# EasyEDA Pro project ProPrj_can sniffer_2026-02-20.epro

# Schematic Schematic1
Board Name: Board1; Create Date: 2026-02-18; Page Name: P1; Project Name: can sniffer; Schematic Name: Schematic1; Update Date: 2026-02-19; Company: EasyEDA.com; Page Size: A4; Version: V1.0
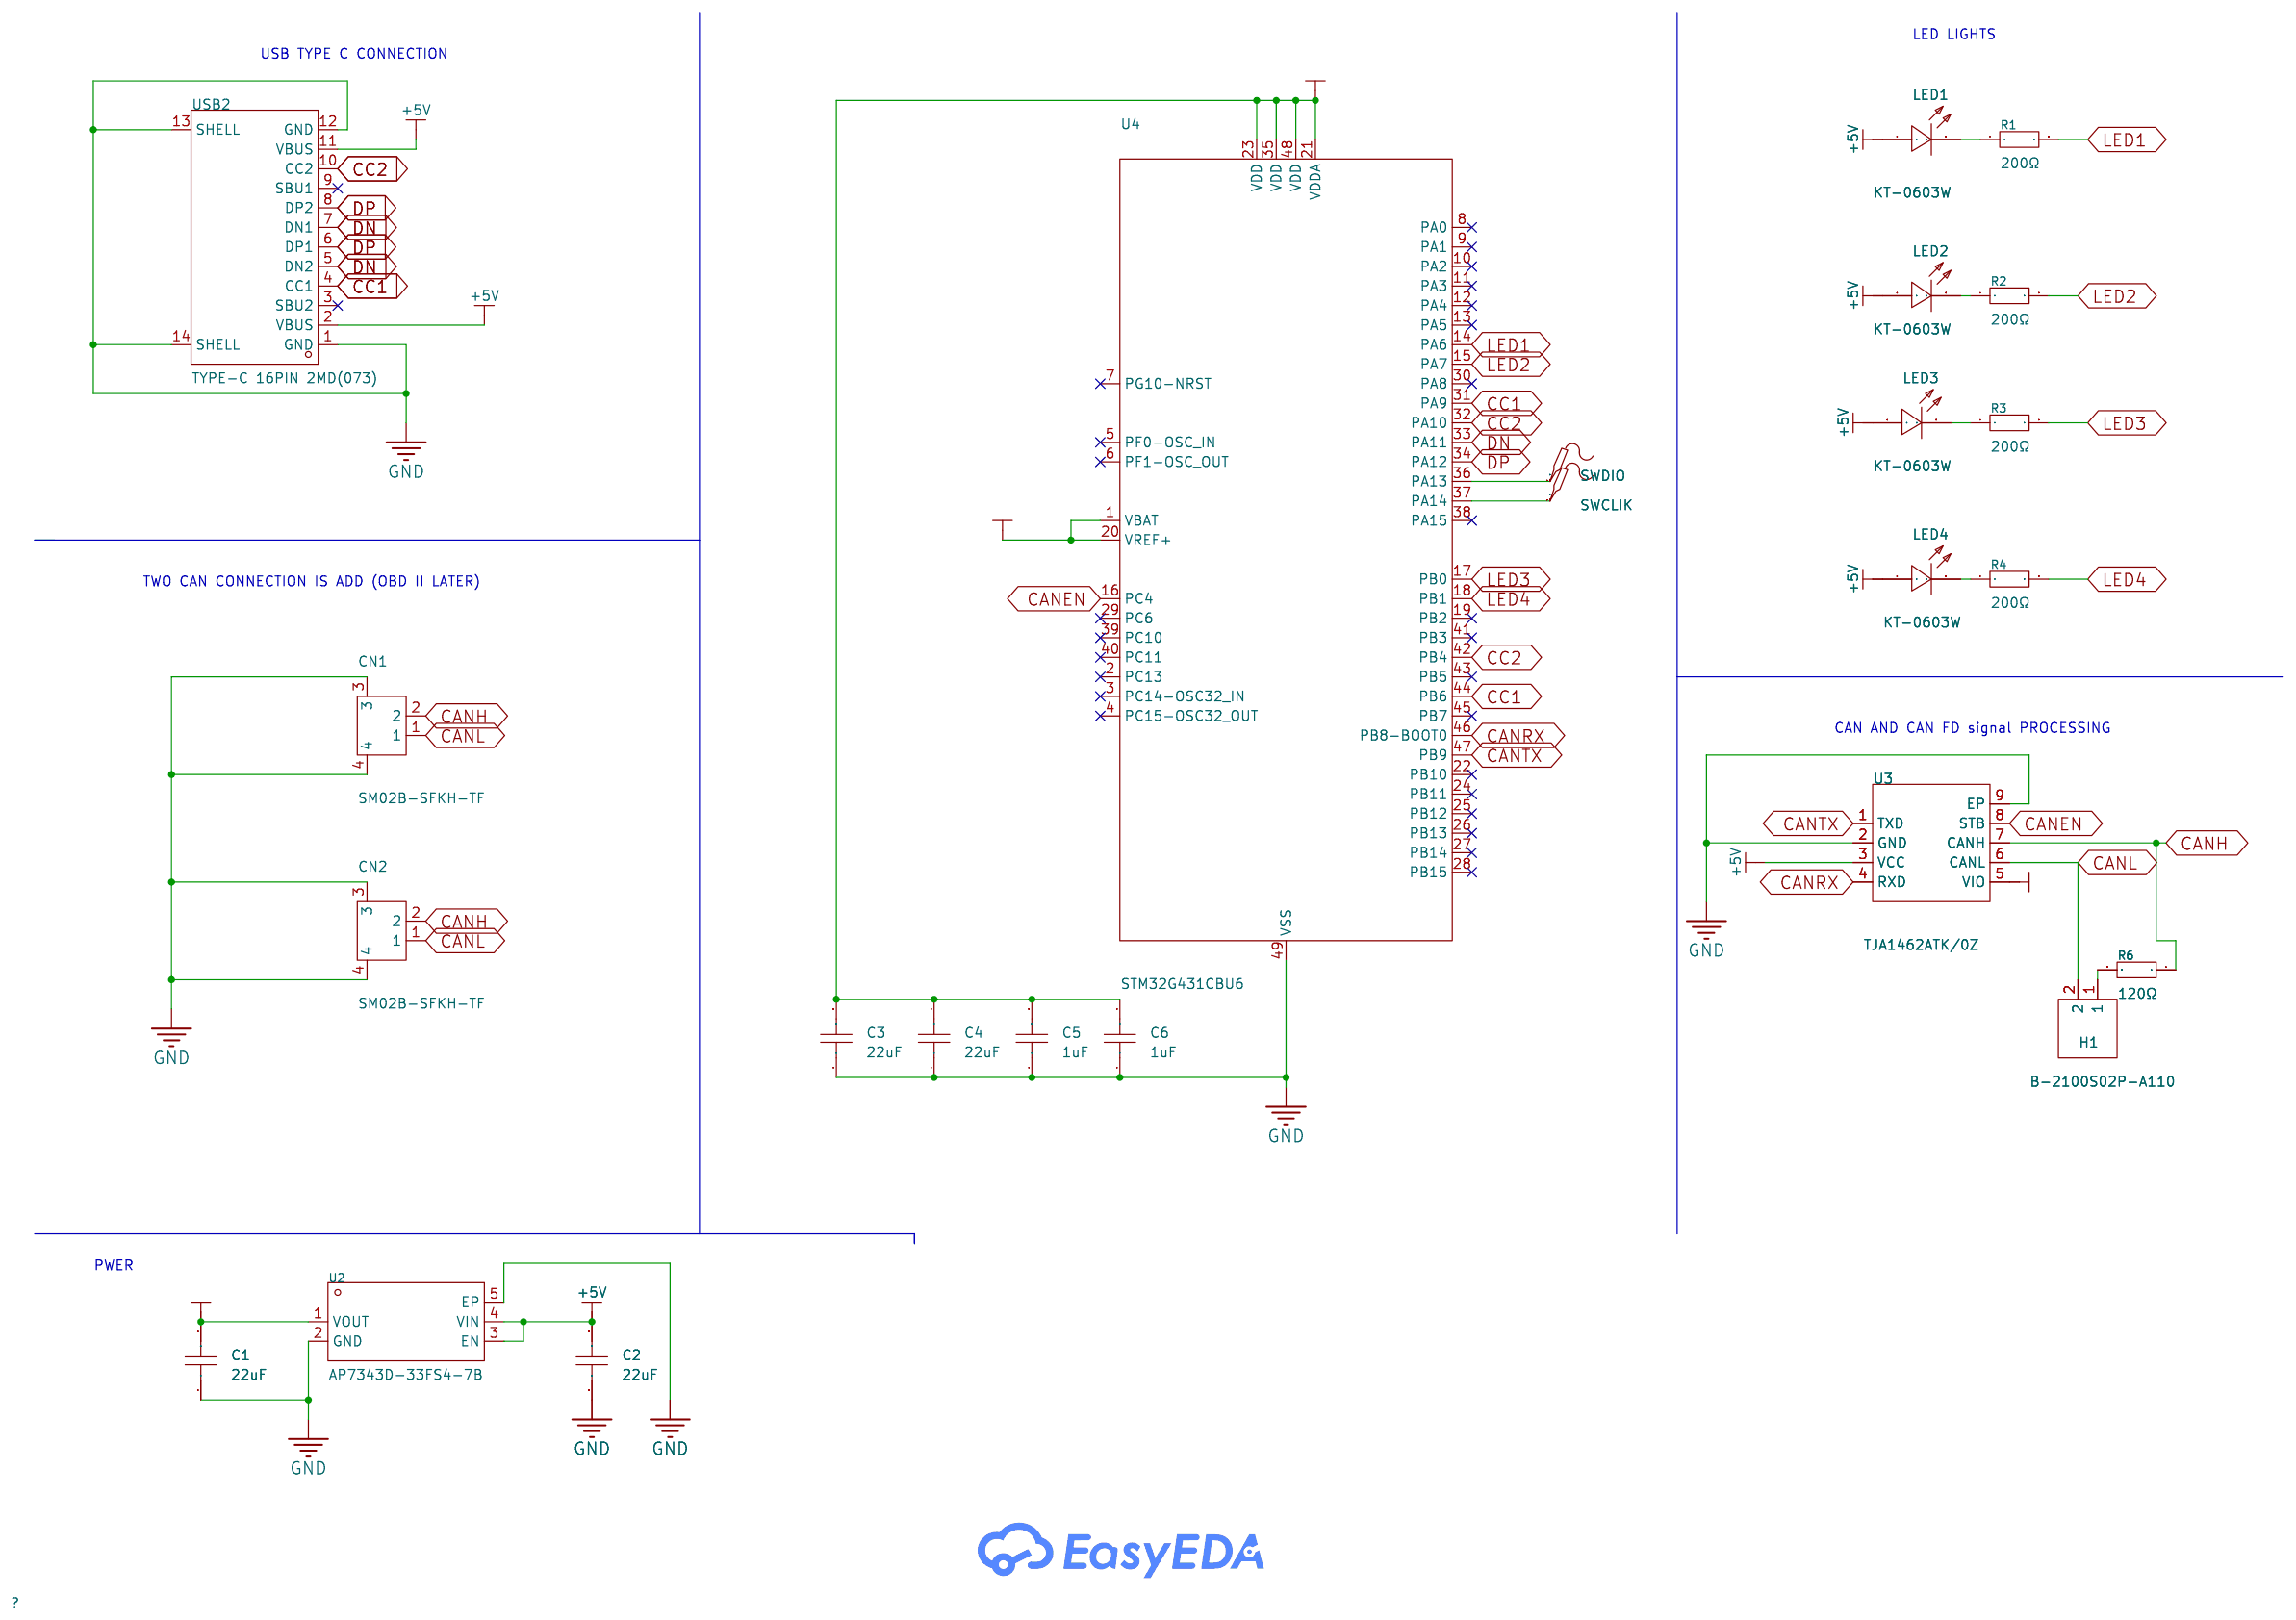
[diagram p0: schematic sheet]

## Parts
C1  22uF  [C0603]
C2  22uF  [C0603]
C3  22uF  [C0603]
C4  22uF  [C0603]
C5  1uF  [C0402]
C6  1uF  [C0402]
CN1  SM02B-SFKH-TF  [CONN-SMD_SM02B-SFKH-TF]
CN2  SM02B-SFKH-TF  [CONN-SMD_SM02B-SFKH-TF]
H1  B-2100S02P-A110  [HDR-TH_2P-P2.54-V-M-1]
LED1  KT-0603W  [LED0603-R-RD_WHITE]
LED2  KT-0603W  [LED0603-R-RD_WHITE]
LED3  KT-0603W  [LED0603-R-RD_WHITE]
LED4  KT-0603W  [LED0603-R-RD_WHITE]
R1  200Ω  [R0402]
R2  200Ω  [R0402]
R3  200Ω  [R0402]
R4  200Ω  [R0402]
R6  120Ω  [R0603]
SWCLIK  -  [Test-Point-0.5mm]
SWDIO  -  [Test-Point-0.5mm]
U2  AP7343D-33FS4-7B  [DFN-4_L1.0-W1.0-P0.65-BL-EP]
U3  TJA1462ATK/0Z  [HVSON-8_L3.0-W3.0-P0.65-TL-EP]
U4  STM32G431CBU6  [VQFN-48_L7.0-W7.0-P0.50-BL-EP5.5]
USB2  TYPE-C 16PIN 2MD(073)  [USB-C-SMD_TYPE-C-6PIN-2MD-073]

## Library data of the parts
C1-C4 = CL10A226MQ8NRNC: Capacitance:22uF Tolerance:±20% Tolerance:±20% Voltage Rating:6.3V Temperature Coefficient:X5R; LCSC Part Name: 22uF ±20% 6.3V; Supplier Part: C59461; Manufacturer: SAMSUNG(三星); Supplier Footprint: 0603; JLCPCB Part Class: Basic Part; Datasheet: https://item.szlcsc.com/datasheet/CL10A226MQ8NRNC/60514.html; Supplier: LCSC; Tolerance: ±20%; Voltage Rating: 6.3V; Temperature Coefficient: X5R
C5 C6 = CL05A105KA5NQNC: Capacitance:1uF Tolerance:±10% Tolerance:±10% Voltage Rating:25V Temperature Coefficient:X5R; LCSC Part Name: 1uF ±10% 25V; Supplier Part: C52923; Manufacturer: SAMSUNG(三星); Supplier Footprint: 0402; JLCPCB Part Class: Basic Part; Datasheet: https://item.szlcsc.com/datasheet/CL05A105KA5NQNC/53938.html; Supplier: LCSC; Tolerance: ±10%; Voltage Rating: 25V; Temperature Coefficient: X5R
CN1 CN2 = SM02B-SFKH-TF: Pins Structure:1x2P Pitch:1.8mm Mounting Type:Surface Mount, Right Angle Number of Pins:2P Number of Rows:1 Number of PINs Per Row:2 Current Rating:4A Contact Material:Brass Contact Plating:Tin Operating Temperature:-25℃~+85℃ Operating Temperature:-25℃~+8; LCSC Part Name: 1x2P 间距:1.8mm 卧贴; Supplier Part: C5329818; Manufacturer: JST; Supplier Footprint: SMD,P=1.8mm,卧贴; JLCPCB Part Class: Extended Part; Datasheet: https://item.szlcsc.com/datasheet/SM02B-SFKH-TF/6088577.html; Supplier: LCSC; Pins Structure: 1x2P; Pitch: 1.8mm; Mounting Type: Surface Mount, Right Angle; Number of Pins: 2P; Number of Rows: 1; Number of PINs Per Row: 2; Current Rating: 4A; Contact Material: Brass; Contact Plating: Tin; Operating Temperature: -25℃~+85℃; Voltage Rating: 250V; Flame Retardant Rating: UL94V-0; Color: Gray
H1 = B-2100S02P-A110: Pin Structure:1x2P Pitch:2.54mm Row Spacing:- Circluar Pins/Square Pins:- Mounting Type:Through Hole Number of Rows:1 Number of Pins:2P Current Rating:- Voltage Rating (Max):- Length of Mating Pin:6mm Insulation Height:2.54mm Length of End Connection Pin:; LCSC Part Name: 2.54直排针; Supplier Part: C124375; Manufacturer: Ckmtw(灿科盟); Supplier Footprint: 插件,P=2.54mm; JLCPCB Part Class: Extended Part; Datasheet: https://item.szlcsc.com/datasheet/B-2100S02P-A110/125650.html; Supplier: LCSC; Pin Structure: 1x2P; Pitch: 2.54mm; Mounting Type: Through Hole; Number of Rows: 1; Number of Pins: 2P; Length of Mating Pin: 6mm; Insulation Height: 2.54mm; Length of End Connection Pin: 3mm; Contact Material: Brass; Operating Temperature: -40℃~+105℃; Color: Black
LED1-LED4 = KT-0603W: Illumination Color:White Voltage - Forward(Vf):2.6V~3.1V Voltage - Forward(Vf):2.6V~3.1V Power(Watts):100mW Forward Current:5mA Diode Configuration:Discrete Diode Lens Color:Yellow Lens Luminous Intensity:360mcd Luminous Intensity:360mcd Viewing Angle:120; LCSC Part Name: 0603 白灯 高亮; Supplier Part: C2290; Manufacturer: KENTO; Supplier Footprint: 0603; JLCPCB Part Class: Basic Part; Datasheet: https://item.szlcsc.com/datasheet/KT-0603W/2663.html; Supplier: LCSC; Illumination Color: White; Voltage - Forward(Vf): 2.6V~3.1V; Power(Watts): 100mW; Forward Current: 5mA; Diode Configuration: Discrete Diode; Lens Color: Yellow Lens; Luminous Intensity: 360mcd; Viewing Angle: 120°; Mounting Style: Top-mount
R1-R4 = 0402WGF2000TCE: Type:Thick Film Resistor Resistance:200Ω Tolerance:±1% Tolerance:±1% Power(Watts):62.5mW Voltage-Supply(Max):50V Temperature Coefficient:±100ppm/℃ Temperature Coefficient:±100ppm/℃ Operating Temperature:-55℃~+155℃ Operating Temperature:-55℃~+155℃; LCSC Part Name: 200Ω ±1% 62.5mW 厚膜电阻; Supplier Part: C25087; Manufacturer: UNI-ROYAL(厚声); Supplier Footprint: 0402; JLCPCB Part Class: Basic Part; Datasheet: https://item.szlcsc.com/datasheet/0402WGF2000TCE/25830.html; Supplier: LCSC; Type: Thick Film Resistor; Tolerance: ±1%; Power(Watts): 62.5mW; Voltage-Supply(Max): 50V; Temperature Coefficient: ±100ppm/℃; Operating Temperature: -55℃~+155℃
R6 = 0603WAF1200T5E: Type:Thick Film Resistor Resistance:120Ω Tolerance:±1% Tolerance:±1% Power(Watts):100mW Voltage-Supply(Max):75V Temperature Coefficient:±100ppm/℃ Temperature Coefficient:±100ppm/℃ Operating Temperature:-55℃~+155℃ Operating Temperature:-55℃~+155℃; LCSC Part Name: 120Ω ±1% 100mW 厚膜电阻; Supplier Part: C22787; Manufacturer: UNI-ROYAL(厚声); Supplier Footprint: 0603; JLCPCB Part Class: Basic Part; Datasheet: https://item.szlcsc.com/datasheet/0603WAF1200T5E/23514.html; Supplier: LCSC; Type: Thick Film Resistor; Tolerance: ±1%; Power(Watts): 100mW; Voltage-Supply(Max): 75V; Temperature Coefficient: ±100ppm/℃; Operating Temperature: -55℃~+155℃
SWCLIK SWDIO = Test-Point: Test Point 测试点
U2 = AP7343D-33FS4-7B: Output Type:Fixed Voltage - Supply:5.25V Output Voltage:3.3V Output Voltage:3.3V Output Current:300mA Power Supply Rejection Ratio (PSRR):75dB@(1kHz) Voltage Dropout:290mV@(300mA) standby current:60uA Noise:60uVrms Features:Enable；Thermal Shutdown；Short C; LCSC Part Name: 输入5.25V 输出3.3V 300mA; Supplier Part: C260892; Manufacturer: DIODES(美台); Supplier Footprint: X2-DFN1010-4-EP; JLCPCB Part Class: Extended Part; Datasheet: https://item.szlcsc.com/datasheet/AP7343D-33FS4-7B/252756.html; Supplier: LCSC; Output Type: Fixed; Voltage - Supply: 5.25V; Output Voltage: 3.3V; Output Current: 300mA; Power Supply Rejection Ratio (PSRR): 75dB@(1kHz); Voltage Dropout: 290mV@(300mA); standby current: 60uA; Noise: 60uVrms; Features: Enable；Thermal Shutdown；Short Circuit Protection; Operating Temperature: -40℃~+85℃@(Ta); Output Configuration: Positive; Number of Outputs: 1
U3 = TJA1462ATK/0Z: Type:CAN FD Transceiver Data Rate:8Mbps Voltage - Supply:4.5V~5.5V Voltage - Supply:4.5V~5.5V Current - Supply:70mA Operating Temperature:-40℃~+150℃ Operating Temperature:-40℃~+150℃ Supply Current (Iq):2uA; LCSC Part Name: 具备待机模式的CAN FD信号增强型收发器; Supplier Part: C3229259; Manufacturer: NXP(恩智浦); Supplier Footprint: HVSON-8-EP(3x3); JLCPCB Part Class: Extended Part; Datasheet: https://www.nxp.com/docs/en/data-sheet/TJA1462.pdf; Supplier: LCSC; Type: CAN FD Transceiver; Data Rate: 8Mbps; Voltage - Supply: 4.5V~5.5V; Current - Supply: 70mA; Operating Temperature: -40℃~+150℃; Supply Current (Iq): 2uA
U4 = STM32G431CBU6: CPU Core:ARM Cortex-M Series CPU Maximum Speed:170MHz Program Storage Size:128KB Program Memory Type:FLASH Number of I/O:42 ADC (Bit):12bit DAC (Bit):12bit Voltage - Supply:1.71V~3.6V Voltage - Supply:1.71V~3.6V Applications:-; LCSC Part Name: 带DSP和FPU的170MHz主流ARM Cortex-M4 MCU，具有128 KB Flash存储器、数学加速器和中等模拟电平集成; Supplier Part: C529356; Manufacturer: ST(意法半导体); Supplier Footprint: UFQFPN-48(7x7); JLCPCB Part Class: Extended Part; Datasheet: https://item.szlcsc.com/datasheet/STM32G431CBU6/549634.html; Supplier: LCSC; CPU Core: ARM Cortex-M Series; CPU Maximum Speed: 170MHz; Program Storage Size: 128KB; Program Memory Type: FLASH; Number of I/O: 42; ADC (Bit): 12bit; DAC (Bit): 12bit; Voltage - Supply: 1.71V~3.6V
USB2 = TYPE-C 16PIN 2MD(073): Connector Type:Type-C Protocol Standard:- Gender:Female Mounting Type:Surface Mount, Right Angle Number of Contacts:16P Number of Ports:1 Current Rating-Power:3A Voltage Rating:5V Connect-Disconnect Life:5,000 times Supplementary Features:- Center Height:; LCSC Part Name: 16P卧贴母座; Supplier Part: C2765186; Manufacturer: SHOU HAN(首韩); Supplier Footprint: SMD; JLCPCB Part Class: Extended Part; Datasheet: https://item.szlcsc.com/datasheet/TYPE-C%252016PIN%25202MD(073)/2901843.html; Supplier: LCSC; Connector Type: Type-C; Gender: Female; Mounting Type: Surface Mount, Right Angle; Number of Contacts: 16P; Number of Ports: 1; Current Rating-Power: 3A; Voltage Rating: 5V; Connect-Disconnect Life: 5,000 times; Detection color: Black; Operating Temperature: -25℃~+85℃

## Nets
3V3: C1.2 C3.2 C4.2 C5.2 C6.2 U2.1(VOUT) U3.5(VIO) U4.1(VBAT) U4.20(VREF+) U4.21(VDDA) U4.23(VDD) U4.35(VDD) U4.48(VDD)
+5V: C2.2 LED1.1(A) LED2.1(A) LED3.1(A) LED4.1(A) U2.3(EN) U2.4(VIN) U3.3(VCC) USB2.2(VBUS) USB2.11(VBUS)
GND: C1.1 C2.1 C3.1 C4.1 C5.1 C6.1 CN1.3 CN1.4 CN2.3 CN2.4 U2.2(GND) U2.5(EP) U3.2(GND) U3.9(EP) U4.49(VSS) USB2.1(GND) USB2.12(GND) USB2.13(SHELL) USB2.14(SHELL)
CANEN: U3.8(STB) U4.16(PC4)
CANH: CN1.2 CN2.2 R6.1 U3.7(CANH)
CANL: CN1.1 CN2.1 H1.2 U3.6(CANL)
CANRX: U3.4(RXD) U4.46(PB8-BOOT0)
CANTX: U3.1(TXD) U4.47(PB9)
CC1: U4.31(PA9) U4.44(PB6) USB2.4(CC1)
CC2: U4.32(PA10) U4.42(PB4) USB2.10(CC2)
DN: U4.33(PA11) USB2.5(DN2) USB2.7(DN1)
DP: U4.34(PA12) USB2.6(DP1) USB2.8(DP2)
LED1: R1.2 U4.14(PA6)
LED2: R2.2 U4.15(PA7)
LED3: R3.2 U4.17(PB0)
LED4: R4.2 U4.18(PB1)
$1N952: LED1.2(K) R1.1
$1N985: LED2.2(K) R2.1
$1N1015: LED3.2(K) R3.1
$1N1045: LED4.2(K) R4.1
$1N5486: H1.1 R6.2
Net-(SWCLIK-1): SWCLIK.1 U4.37(PA14)
Net-(SWDIO-1): SWDIO.1 U4.36(PA13)

Not connected (* = marked no-connect by the designer): U4 2(PC13)* 3(PC14-OSC32_IN)* 4(PC15-OSC32_OUT)* 5(PF0-OSC_IN)* 6(PF1-OSC_OUT)* 7(PG10-NRST)* 8(PA0)* 9(PA1)* 10(PA2)* 11(PA3)* 12(PA4)* 13(PA5)* 19(PB2)* 22(PB10)* 24(PB11)* 25(PB12)* 26(PB13)* 27(PB14)* 28(PB15)* 29(PC6)* 30(PA8)* 38(PA15)* 39(PC10)* 40(PC11)* 41(PB3)* 43(PB5)* 45(PB7)*; USB2 3(SBU2)* 9(SBU1)*

## Notes on the sheet
- LED LIGHTS
- USB TYPE C CONNECTION
- TWO CAN CONNECTION IS ADD (OBD II LATER)
- CAN AND CAN FD signal PROCESSING
- PWER

# Board PCB1
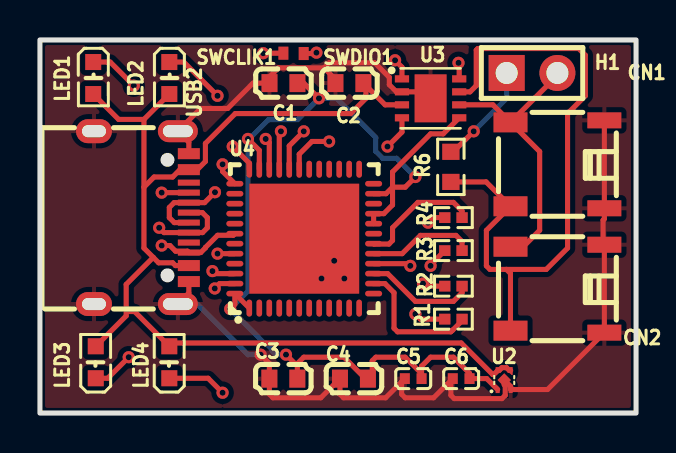
[diagram p1: board, top side]
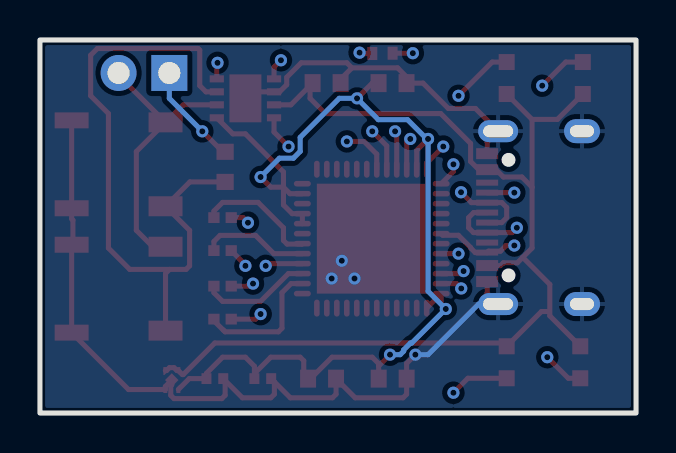
[diagram p2: board, bottom side, seen from below]

Outline 29.84 x 18.67 mm; copper layers: Top Layer, Inner1, Inner2, Bottom Layer. Coordinates in mm from the lower left corner of the outline.
Outline path: rectangle 0,18.67 29.84,0
Stack: Top Layer 0.035mm Outer layer thickness 1oz / Dielectric1 0.2104mm 7628 RC49% 8.6mil / Inner1 0.0152mm Inner layer thickness / Dielectric2 1.065mm 1.1mm H/HOZ Copper / Inner2 0.0152mm Inner layer thickness / Dielectric3 0.2104mm 7628 RC49% 8.6mil / Bottom Layer 0.035mm Outer layer thickness 1oz

## Design rules (mm)
template: JLCPCB Capability(Two Layers Board)
spacing copperThickness1oz (default): track to track 0.102, other pairs 0.152 to 0.3
spacing copperThickness2oz: track to track 0.203, other pairs 0.152 to 0.3
track width copperThickness1oz (default): min 0.127, default 0.254, max 2.54
track width copperThickness2oz: min 0.203, default 0.254, max 2.54
differential pair differentialPair (default): width min 0.127, default 0.254, max 2.54; gap min 0.152, default 0.152
via viaSize (default): diameter min 0.5, default 0.61, max 10; hole min 0.3, default 0.305, max 6.3

## Placement (name value [footprint] x y rotation side)
C1  22uF  [C0603]  12.19 16.51 0 top
C2  22uF  [C0603]  15.49 16.51 0 top
C3  22uF  [C0603]  12.19 1.72 0 top
C4  22uF  [C0603]  15.72 1.72 0 top
C5  1uF  [C0402]  18.69 1.72 0 top
C6  1uF  [C0402]  21.09 1.72 0 top
CN1  SM02B-SFKH-TF  [CONN-SMD_SM02B-SFKH-TF]  25.91 12.45 180 top
CN2  SM02B-SFKH-TF  [CONN-SMD_SM02B-SFKH-TF]  25.91 6.22 180 top
H1  B-2100S02P-A110  [HDR-TH_2P-P2.54-V-M-1]  24.64 17.02 0 top
LED1  KT-0603W  [LED0603-R-RD_WHITE]  2.67 16.76 270 top
LED2  KT-0603W  [LED0603-R-RD_WHITE]  6.48 16.76 270 top
LED3  KT-0603W  [LED0603-R-RD_WHITE]  2.79 2.54 90 top
LED4  KT-0603W  [LED0603-R-RD_WHITE]  6.48 2.54 90 top
R1  200Ω  [R0402]  20.7 4.7 0 top
R2  200Ω  [R0402]  20.7 6.35 0 top
R3  200Ω  [R0402]  20.7 8.13 0 top
R4  200Ω  [R0402]  20.7 9.78 0 top
R6  120Ω  [R0603]  20.57 12.32 90 top
SWCLIK1  -  [Test-Point-0.5mm]  12.19 18.01 0 top
SWDIO1  -  [Test-Point-0.5mm]  13.2 17.99 0 top
U2  AP7343D-33FS4-7B  [DFN-4_L1.0-W1.0-P0.65-BL-EP]  23.24 1.65 0 top
U3  TJA1462ATK/0Z  [HVSON-8_L3.0-W3.0-P0.65-TL-EP]  19.56 15.75 0 top
U4  STM32G431CBU6  [VQFN-48_L7.0-W7.0-P0.50-BL-EP5.5]  13.23 8.73 0 top
USB2  TYPE-C 16PIN 2MD(073)  [USB-C-SMD_TYPE-C-6PIN-2MD-073]  5.08 9.78 270 top

## Footprints (pads in the part's own frame, mm; a bottom-side part is the same pattern mirrored in y, then rotated)
C0402
  rect 0.5x0.54 smd: 1(-0.42,0) 2(0.42,0)
C0603
  rect 0.8x0.9 smd: 1(-0.7,0) 2(0.7,0)
CONN-SMD_SM02B-SFKH-TF
  rect 1.7x1 smd: 1(2.35,-2.1) 2(2.35,2.1)
  rect 1.7x0.8 smd: 3(-2.35,2.2) 4(-2.35,-2.2)
DFN-4_L1.0-W1.0-P0.65-BL-EP
  custom 0.2x0.4 smd: 1(-0.325,-0.475) 2(0.325,-0.474) 3(0.325,0.475) 4(-0.325,0.475)
  rect 0.48x0.48 smd rot 45: 5(0.004,0.001)
HDR-TH_2P-P2.54-V-M-1
  rect 1.8x1.8 hole 1.1: 1(-1.27,0)
  round 1.8 hole 1.1: 2(1.27,0)
HVSON-8_L3.0-W3.0-P0.65-TL-EP
  rect 0.711x0.355 smd: 1(-1.433,0.975) 2(-1.433,0.325) 3(-1.433,-0.325) 4(-1.433,-0.975) 5(1.433,-0.975) 6(1.433,-0.325) 7(1.433,0.325) 8(1.433,0.975)
  rect 1.6x2.4 smd: 9(0,0)
LED0603-R-RD_WHITE
  rect 0.8x0.8 smd: 1(0.8,0) 2(-0.8,0)
R0402
  rect 0.566x0.54 smd: 1(-0.433,0) 2(0.433,0)
R0603
  rect 0.806x0.864 smd: 1(-0.753,0) 2(0.753,0)
Test-Point-0.5mm
  rect 0.5x0.653 smd: 1(0,0)
USB-C-SMD_TYPE-C-6PIN-2MD-073
  rect 0.55x1.1 smd: 1(-3.2,2.375) 2(-2.4,2.375) 11(2.4,2.375) 12(3.2,2.375)
  rect 0.3x1.1 smd: 3(-1.75,2.375) 4(-1.25,2.375) 5(-0.75,2.375) 6(-0.25,2.375) 7(0.25,2.375) 8(0.75,2.375) 9(1.25,2.375) 10(1.75,2.375)
  oval 1.1x2 hole 0.6x1.5: 13(-4.325,1.825) 14(4.325,1.825)
  oval 1.2x1.8 hole 0.6x1.2: 13(-4.325,-2.375) 14(4.325,-2.375)
VQFN-48_L7.0-W7.0-P0.50-BL-EP5.5
  oval 0.28x0.85 smd: 1(-2.75,-3.474) 2(-2.25,-3.474) 3(-1.75,-3.474) 4(-1.25,-3.474) 5(-0.75,-3.474) 6(-0.25,-3.474) 7(0.25,-3.474) 8(0.75,-3.474) 9(1.25,-3.474) 10(1.75,-3.474) 11(2.25,-3.474) 12(2.75,-3.474) 25(2.75,3.474) 26(2.25,3.474) 27(1.75,3.474) 28(1.25,3.474) 29(0.75,3.474) 30(0.25,3.474) 31(-0.25,3.474) 32(-0.75,3.474) 33(-1.25,3.474) 34(-1.75,3.474) 35(-2.25,3.474) 36(-2.75,3.474)
  oval 0.85x0.28 smd: 13(3.474,-2.75) 14(3.474,-2.25) 15(3.474,-1.75) 16(3.474,-1.25) 17(3.474,-0.75) 18(3.474,-0.25) 19(3.474,0.25) 20(3.474,0.75) 21(3.474,1.25) 22(3.474,1.75) 23(3.474,2.25) 24(3.474,2.75) 37(-3.474,2.75) 38(-3.474,2.25) 39(-3.474,1.75) 40(-3.474,1.25) 41(-3.474,0.75) 42(-3.474,0.25) 43(-3.474,-0.25) 44(-3.474,-0.75) 45(-3.474,-1.25) 46(-3.474,-1.75) 47(-3.474,-2.25) 48(-3.474,-2.75)
  rect 5.5x5.5 smd: 49(0,0)

## Nets
As in the schematic, except:
$1N6179: SWCLIK1.1 U4.37
$1N6197: SWDIO1.1 U4.36

Pads without a net: U4 2 3 4 5 6 7 8 9 10 11 12 13 19 22 24 25 26 27 28 29 30 38 39 40 41 43 45; USB2 3 9

## Via types
v1: diameter 0.61, hole 0.305, Top Layer to Bottom Layer, 37 vias

## Routing (per net, layer and track width the routed paths; a pad name or vN(x,y) marks a point on that pad's centre or on a via; arc(x,y) is an arc through that point)
3V3: length 54.1
  Top Layer w0.254: 12.89,2.35 12.89,2.47 13.21,2.79 15.22,2.79 16.29,1.72 C4.2 16.64,1.94 16.64,2.61 16.82,2.79 18.29,2.79 19.11,1.97 ; 12.89,2.35 v1(12.32,2.92) ; 12.89,2.35 C3.2 ; v1(13.97,15.75) 13.21,16.51 C1.2 ; 17.65,11.3 17.33,10.98 U4.23 ; 17.65,11.3 18.29,11.3 v1(18.8,11.81) ; 17.65,11.3 17.65,12.06 19.56,13.97 20.19,13.97 U3.5 ; 17.65,11.3 17.65,10.41 17.22,9.98 U4.21 U4.20 ; 19.11,1.97 19.11,2.34 19.56,2.79 20.7,2.79 21.51,1.99 C6.2 22.37,1.72 U2.1 ; 19.11,1.97 C5.2 ; U4.35 10.98,13.15 v1(10.41,13.72) ; U4.1 9.76,5.98 9.76,5.44 v1(9.53,5.21)
  Bottom Layer w0.254: v1(18.8,11.81) 17.86,12.75 17.16,12.75 16.81,13.09 16.81,13.79 14.86,15.75 v1(13.97,15.75) 12.9,14.68 11.44,14.68 10.48,13.72 v1(10.41,13.72) 10.41,6.1 v1(9.53,5.21) 11.23,3.5 11.29,3.5 11.63,3.16 11.63,3.1 11.81,2.92 v1(12.32,2.92)
+5V: length 56.6
  Top Layer w0.254: 16.32,16.38 17.28,15.42 U3.3 ; 16.32,16.38 16.32,15.75 15.56,14.99 9.78,14.99 8.28,13.49 8.28,12.59 7.87,12.18 USB2.2 7.01,12.18 6.64,11.81 5.72,11.81 5.21,11.3 ; 16.32,16.38 C2.2 ; 5.67,7.79 4.32,6.44 4.32,4.86 2.79,3.34 ; 5.67,7.79 5.21,8.25 5.21,11.3 ; 5.67,7.79 5.94,7.52 6.65,7.52 6.78,7.38 USB2.11 ; LED1.1 3.94,14.69 5.21,14.69 ; U2.3 23.5,2.13 23.36,2.27 23.13,2.27 22.99,2.13 U2.4 22.71,1.92 22.67,1.92 21.09,3.5 6.68,3.5 6.67,3.49 ; 6.48,3.34 4.74,5.08 4.45,5.08 ; 5.21,11.3 5.21,14.69 ; 5.21,14.69 LED2.1
GND: length 60
  Top Layer w0.254: 14.22,17.27 14.48,17.53 16.76,17.53 17.49,16.8 17.49,16.43 17.85,16.07 U3.2 19.23,16.07 U3.9 ; 14.22,17.27 14.79,16.7 C2.1 ; 14.22,17.27 11.94,17.27 11.49,16.83 C1.1 10.67,16.51 9.4,15.24 8.04,15.24 USB2.13 7.46,13.55 USB2.1 ; USB2.14 7.46,6 USB2.12 ; 18.11,1.56 17.31,0.76 15.2,0.76 15.02,0.94 C4.1 14.06,0.76 11.67,0.76 11.49,0.94 C3.1 11.49,2.48 v1(11.05,2.92) ; 18.11,1.56 C5.1 ; 18.11,1.56 18.11,0.94 18.29,0.76 19.71,0.76 20.57,1.63 ; 20.57,1.63 C6.1 ; 20.57,1.63 20.57,0.89 20.74,0.72 23.13,0.72 23.3,0.88 23.3,1.37 23.25,1.42 U2.5 23.57,1.33 U2.2 25.41,1.18 CN2.3 CN2.4 28.19,8.49 28.19,9.65 28.26,9.72 CN1.3 CN1.4
  Bottom Layer w0.254: USB2.14 7.88,5.45 10.41,2.92 v1(11.05,2.92)
  vias: v1(14.1,6.73) v1(14.73,7.62) v1(15.24,6.73)
CANEN: length 13.9
  Top Layer w0.254: v1(18.54,7.37) 18.43,7.48 U4.16 ; U3.8 20.99,17.49 v1(20.96,17.53)
  Inner1 w0.254: v1(18.54,7.37) 18.85,7.67 18.85,9.77 20.96,11.88 v1(20.96,17.53)
CANH: length 33.1
  Top Layer w0.254: R6.1 22.34,11.57 CN1.2 22.35,9.14 22.35,7.37 22.53,7.19 23.36,7.19 ; CN2.2 23.56,6.98 23.36,7.19 ; 23.36,7.19 25.35,7.19 26.42,8.25 26.42,14.99 27.31,15.88 27.31,17.91 26.97,18.24 21.93,18.24 21.84,18.16 21.84,16.38 21.53,16.07 U3.7
CANL: length 14.2
  Top Layer w0.254: CN2.1 24.2,8.32 25.02,9.14 25.02,13.08 CN1.1 ; CN1.1 25.91,16.9 H1.2 ; CN1.1 22.68,15.42 U3.6
CANRX: length 14.3
  Top Layer w0.254: v1(8.64,7.1) 8.76,6.98 9.76,6.98 ; v1(17.4,13.33) 18.13,14.06 U3.4
  Inner2 w0.254: v1(8.64,7.1) 11.17,7.1 v1(17.4,13.33)
CANTX: length 20.1
  Top Layer w0.254: U3.1 18.13,17.31 v1(17.78,17.65) ; v1(8.75,6.23) 8.99,6.48 9.76,6.48
  Inner2 w0.254: v1(17.78,17.65) 19.05,16.38 19.05,13.59 11.7,6.23 v1(8.75,6.23)
CC1: length 21.5
  Top Layer w0.254: U4.31 12.98,12.95 13.62,13.59 v1(14.48,13.59) ; USB2.4 v1(6.1,11.03) ; 9.76,7.98 v1(8.89,7.98)
  Inner2 w0.254: v1(14.48,13.59) 14.48,11.56 11.05,8.13 9.04,8.13 v1(8.89,7.98) 6.52,7.98 6.34,7.8 5.85,7.8 5.68,7.98 5.01,7.98 4.83,8.16 4.83,9.76 v1(6.1,11.03)
CC2: length 18
  Top Layer w0.254: v1(6.1,8.38) 6.51,8.38 6.79,8.1 7.38,8.1 USB2.10 8.05,8.03 8.28,8.26 8.28,8.28 8.89,8.89 9.68,8.89 9.76,8.98 ; v1(13.21,14.1) 12.48,13.37 U4.32
  Inner2 w0.254: v1(13.21,14.1) 13.59,13.72 13.59,11.56 13.41,11.38 12.39,11.38 9.5,8.48 9.21,8.48 9.13,8.56 8.65,8.56 8.47,8.38 v1(6.1,8.38)
DN: length 12.1
  Top Layer w0.254: USB2.7 6.73,9.53 6.48,9.78 6.48,10.29 6.72,10.53 USB2.5 8.24,10.53 v1(8.76,11.05) ; U4.33 11.98,14.01 v1(12.06,14.1)
  Inner2 w0.254: v1(12.06,14.1) 12.06,12.06 10.8,10.8 9.02,10.8 v1(8.76,11.05)
DP: length 13.3
  Top Layer w0.254: v1(11.3,13.72) 11.48,13.54 U4.34 ; USB2.6 8.13,10.03 8.38,9.78 8.38,9.27 8.14,9.03 USB2.8 6.21,9.03 v1(5.97,9.27)
  Inner2 w0.254: v1(5.97,9.27) 6.86,9.27 8.18,10.59 8.18,11.29 8.52,11.63 9.22,11.63 v1(11.3,13.72)
LED1: length 6.8
  Top Layer w0.254: R1.2 21.13,4.62 20.67,4.15 20.66,4.15 20.57,4.06 17.91,4.06 17.73,4.24 17.73,6.02 17.27,6.48 16.71,6.48
LED2: length 5.5
  Top Layer w0.254: R2.2 21.13,6.02 20.7,5.59 18.8,5.59 17.41,6.98 U4.15
LED3: length 5.4
  Top Layer w0.254: R3.2 21.13,8.58 20.83,8.89 19.05,8.89 18.14,7.98 U4.17
LED4: length 6.2
  Top Layer w0.254: R4.2 21.13,10.11 20.7,10.54 18.92,10.54 17.65,9.27 17.65,8.64 17.47,8.46 16.73,8.46 U4.18
$1N952: length 24.7
  Top Layer w0.254: v1(18.8,4.95) 19.05,4.7 R1.1 ; LED1.2 3.52,17.56 v1(4.7,16.38)
  Inner1 w0.254: v1(18.8,4.95) 11.89,11.86 8.9,11.86 8.56,12.2 8.56,15.19 7.37,16.38 v1(4.7,16.38)
$1N985: length 23
  Top Layer w0.254: v1(8.89,15.88) 7.2,17.56 LED2.2 ; v1(19.18,6.48) 19.3,6.35 R2.1
  Inner1 w0.254: v1(19.18,6.48) 18.16,6.48 11.89,12.75 11.89,13.47 11.93,13.51 13.45,13.51 13.79,13.85 13.79,14.34 13.45,14.68 9.96,14.68 8.89,15.75 v1(8.89,15.88)
$1N1015: length 22.6
  Top Layer w0.254: v1(19.56,7.37) 19.56,7.42 R3.1 ; v1(4.45,2.79) 3.39,1.74 LED3.2
  Inner1 w0.254: v1(4.45,2.79) 10.35,2.79 10.81,2.34 12.56,2.34 13.02,2.79 17.65,2.79 20.19,5.33 20.19,6.73 v1(19.56,7.37)
$1N1045: length 22.6
  Top Layer w0.254: v1(9.14,1.02) 8.42,1.74 LED4.2 ; R4.1 19.69,9.78 v1(19.43,9.52)
  Inner1 w0.254: v1(19.43,9.52) 21.34,7.62 21.34,5.84 16.51,1.02 v1(9.14,1.02)
$1N5486: length 5.2
  Top Layer w0.254: v1(21.72,14.1) 20.69,13.07 R6.2
  Bottom Layer w0.254: v1(21.72,14.1) 23.37,15.75 H1.1
$1N6179: length 8.7
  Top Layer w0.254: 9.76,11.48 9.14,12.09 v1(9.14,12.45) ; SWCLIK1.1 v1(11.18,18.01)
  Inner2 w0.254: v1(11.18,18.01) 9.47,16.3 9.47,13.98 9.07,13.58 9.07,13.09 9.14,13.02 v1(9.14,12.45)
$1N6197: length 8.8
  Top Layer w0.254: SWDIO1.1 13.8,17.99 v1(13.84,18.03) ; U4.36 10.48,12.51 v1(9.65,13.33)
  Inner2 w0.254: v1(13.84,18.03) 13.84,17.53 10.62,14.3 10.17,14.3 9.83,13.96 9.83,13.51 v1(9.65,13.33)

## Copper pours and planes (outline as drawn; the poured copper is in the pictures)
GND on Top Layer: 0,18.45 29.84,18.45 29.84,0 0,0
GND on Bottom Layer: 0,18.67 29.84,18.67 29.84,0 0,0
GND on Inner1: 0,18.67 29.84,18.67 29.84,0 0,0
GND on Inner2: 0,18.67 29.84,18.67 29.84,0 0,0
